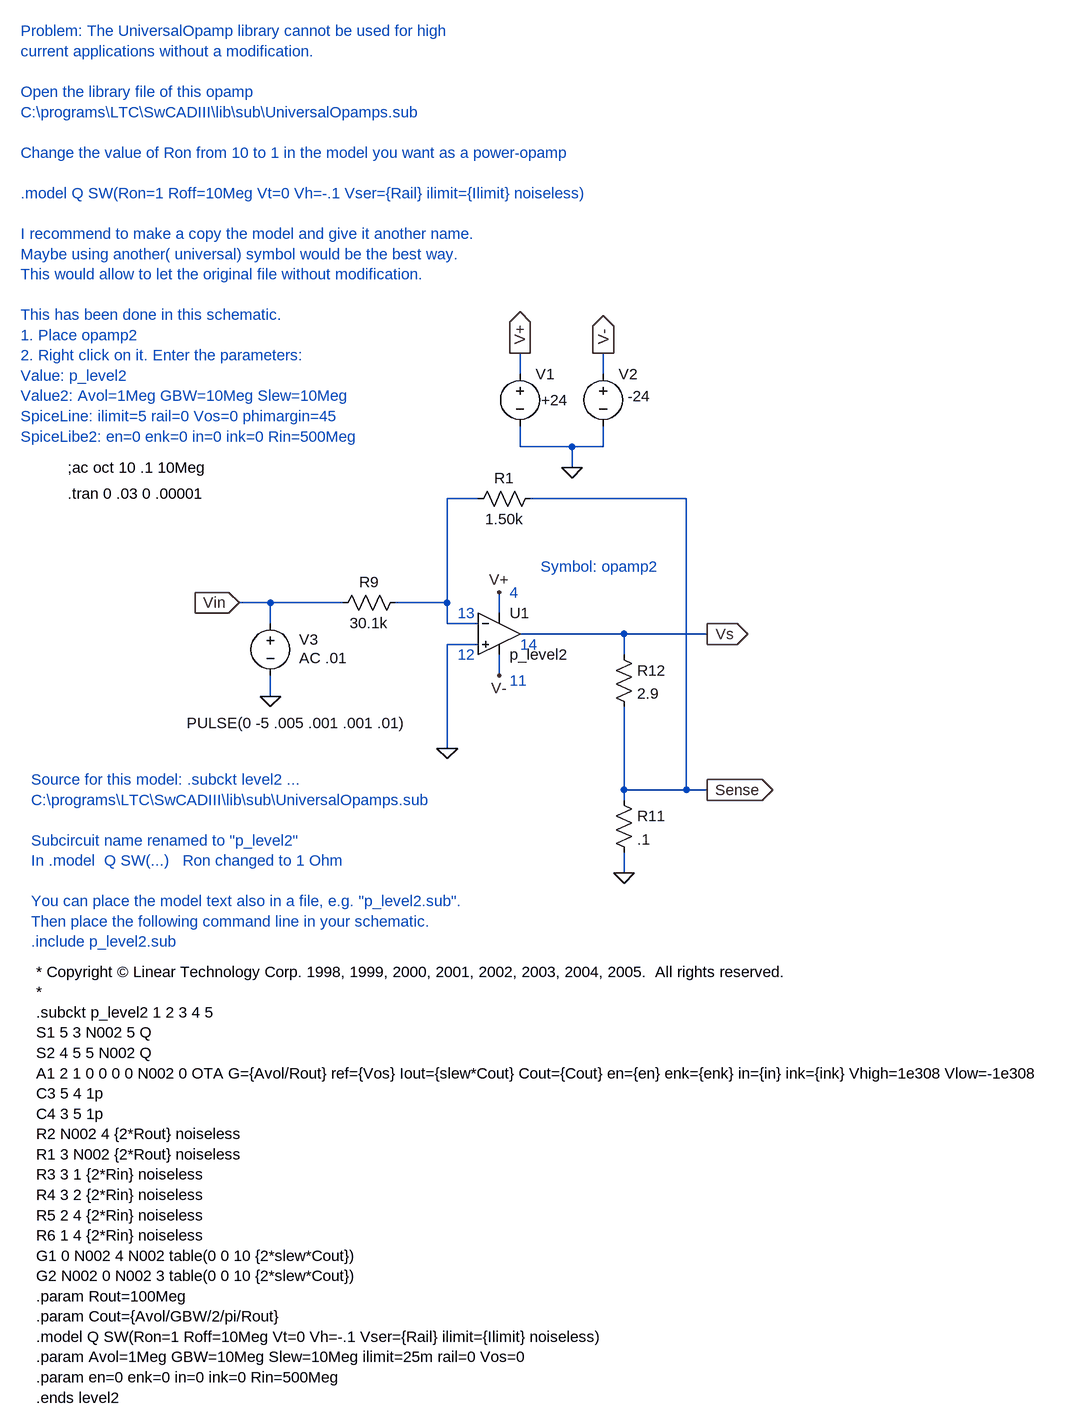
[diagram p0: schematic Power_universalopamp.asc]
Power_universalopamp.asc, the LTspice schematic file:
Version 4
SHEET 1 1204 1316
WIRE -272 144 -320 144
WIRE -272 176 -272 144
WIRE -272 288 -272 256
WIRE -160 144 -272 144
WIRE 0 144 -80 144
WIRE 0 144 0 -16
WIRE 0 176 0 144
WIRE 0 368 0 208
WIRE 48 -16 0 -16
WIRE 48 176 0 176
WIRE 48 208 0 208
WIRE 80 160 80 128
WIRE 80 256 80 224
WIRE 112 -208 112 -240
WIRE 112 -96 112 -128
WIRE 192 -96 112 -96
WIRE 192 -64 192 -96
WIRE 240 -208 240 -240
WIRE 240 -96 192 -96
WIRE 240 -96 240 -128
WIRE 272 192 112 192
WIRE 272 224 272 192
WIRE 272 432 272 304
WIRE 272 448 272 432
WIRE 272 560 272 528
WIRE 368 -16 128 -16
WIRE 368 432 272 432
WIRE 368 432 368 -16
WIRE 400 192 272 192
WIRE 400 432 368 432
FLAG 112 -240 V+
IOPIN 112 -240 Out
FLAG 240 -240 V-
IOPIN 240 -240 Out
FLAG -320 144 Vin
IOPIN -320 144 In
FLAG 192 -64 0
FLAG -272 288 0
FLAG 0 368 0
FLAG 80 128 V+
FLAG 80 256 V-
FLAG 272 560 0
FLAG 400 192 Vs
IOPIN 400 192 Out
FLAG 400 432 Sense
IOPIN 400 432 Out
SYMBOL voltage 112 -224 R0
WINDOW 3 33 56 Left 0
WINDOW 123 0 0 Left 0
WINDOW 39 0 0 Left 0
SYMATTR Value +24
SYMATTR InstName V1
SYMBOL voltage 240 -224 R0
WINDOW 3 38 50 Left 0
WINDOW 123 0 0 Left 0
WINDOW 39 0 0 Left 0
SYMATTR Value -24
SYMATTR InstName V2
SYMBOL voltage -272 160 R0
WINDOW 3 -129 169 Left 0
WINDOW 123 44 69 Left 0
WINDOW 39 0 0 Left 0
WINDOW 0 44 41 Left 0
SYMATTR Value PULSE(0 -5 .005 .001 .001 .01)
SYMATTR Value2 AC .01
SYMATTR InstName V3
SYMBOL res 32 0 R270
WINDOW 0 32 56 VTop 0
WINDOW 3 0 56 VBottom 0
SYMATTR InstName R1
SYMATTR Value 1.50k
SYMBOL res -176 160 R270
WINDOW 0 32 56 VTop 0
WINDOW 3 0 56 VBottom 0
SYMATTR InstName R9
SYMATTR Value 30.1k
SYMBOL res 256 432 R0
SYMATTR InstName R11
SYMATTR Value .1
SYMBOL res 256 208 R0
SYMATTR InstName R12
SYMATTR Value 2.9
SYMBOL Opamps\\opamp2 80 128 R0
SYMATTR InstName U1
SYMATTR Value p_level2
SYMATTR Value2 Avol=1Meg GBW=10Meg Slew=10Meg
SYMATTR SpiceLine ilimit=5 rail=0 Vos=0 phimargin=45
SYMATTR SpiceLine2 en=0 enk=0 in=0 ink=0 Rin=500Meg
TEXT 16 160 Left 0 ;13
TEXT 16 224 Left 0 ;12
TEXT 112 208 Left 0 ;14
TEXT 96 264 Left 0 ;11
TEXT 96 128 Left 0 ;4
TEXT -584 -24 Left 0 !.tran 0 .03 0 .00001
TEXT -584 -64 Left 0 !;ac oct 10 .1 10Meg
TEXT -656 -736 Left 0 ;Problem: The UniversalOpamp library cannot be used for high\ncurrent applications without a modification.\n \nOpen the library file of this opamp \nC:\\programs\\LTC\\SwCADIII\\lib\\sub\\UniversalOpamps.sub\n \nChange the value of Ron from 10 to 1 in the model you want as a power-opamp\n  \n.model Q SW(Ron=1 Roff=10Meg Vt=0 Vh=-.1 Vser={Rail} ilimit={Ilimit} noiseless)\n \nI recommend to make a copy the model and give it another name. \nMaybe using another( universal) symbol would be the best way.\nThis would allow to let the original file without modification.\n \nThis has been done in this schematic.\n1. Place opamp2\n2. Right click on it. Enter the parameters:\nValue: p_level2\nValue2: Avol=1Meg GBW=10Meg Slew=10Meg\nSpiceLine: ilimit=5 rail=0 Vos=0 phimargin=45\nSpiceLibe2: en=0 enk=0 in=0 ink=0 Rin=500Meg
TEXT -632 712 Left 0 !* Copyright © Linear Technology Corp. 1998, 1999, 2000, 2001, 2002, 2003, 2004, 2005.  All rights reserved.\n*\n.subckt p_level2 1 2 3 4 5\nS1 5 3 N002 5 Q\nS2 4 5 5 N002 Q\nA1 2 1 0 0 0 0 N002 0 OTA G={Avol/Rout} ref={Vos} Iout={slew*Cout} Cout={Cout} en={en} enk={enk} in={in} ink={ink} Vhigh=1e308 Vlow=-1e308\nC3 5 4 1p\nC4 3 5 1p\nR2 N002 4 {2*Rout} noiseless\nR1 3 N002 {2*Rout} noiseless\nR3 3 1 {2*Rin} noiseless\nR4 3 2 {2*Rin} noiseless\nR5 2 4 {2*Rin} noiseless\nR6 1 4 {2*Rin} noiseless\nG1 0 N002 4 N002 table(0 0 10 {2*slew*Cout})\nG2 N002 0 N002 3 table(0 0 10 {2*slew*Cout})\n.param Rout=100Meg\n.param Cout={Avol/GBW/2/pi/Rout}\n.model Q SW(Ron=1 Roff=10Meg Vt=0 Vh=-.1 Vser={Rail} ilimit={Ilimit} noiseless)\n.param Avol=1Meg GBW=10Meg Slew=10Meg ilimit=25m rail=0 Vos=0\n.param en=0 enk=0 in=0 ink=0 Rin=500Meg\n.ends level2
TEXT -640 416 Left 0 ;Source for this model: .subckt level2 ...\nC:\\programs\\LTC\\SwCADIII\\lib\\sub\\UniversalOpamps.sub\n \nSubcircuit name renamed to "p_level2"\nIn .model  Q SW(...)   Ron changed to 1 Ohm\n \nYou can place the model text also in a file, e.g. "p_level2.sub".\nThen place the following command line in your schematic.\n.include p_level2.sub
TEXT 144 88 Left 0 ;Symbol: opamp2

The netlist it stands for:
* Power_universalopamp.asc
V1 V+ 0 +24
V2 V- 0 -24
V3 Vin 0 PULSE(0 -5 .005 .001 .001 .01) AC .01
R1 N001 Sense 1.50k
R9 Vin N001 30.1k
R11 Sense 0 .1
R12 Vs Sense 2.9
XU1 0 N001 V+ V- Vs p_level2 Avol=1Meg GBW=10Meg Slew=10Meg ilimit=5 rail=0 Vos=0 phimargin=45 en=0 enk=0 in=0 ink=0 Rin=500Meg  ; pins In+ In- V+ V- OUT
* 13
* 12
* 14
* 11
* 4
.tran 0 .03 0 .00001
;ac oct 10 .1 10Meg
* Problem: The UniversalOpamp library cannot be used for high
* current applications without a modification.
* Open the library file of this opamp
* C:\programs\LTC\SwCADIII\lib\sub\UniversalOpamps.sub
* Change the value of Ron from 10 to 1 in the model you want as a power-opamp
* .model Q SW(Ron=1 Roff=10Meg Vt=0 Vh=-.1 Vser={Rail} ilimit={Ilimit} noiseless)
* I recommend to make a copy the model and give it another name.
* Maybe using another( universal) symbol would be the best way.
* This would allow to let the original file without modification.
* This has been done in this schematic.
* 1. Place opamp2
* 2. Right click on it. Enter the parameters:
* Value: p_level2
* Value2: Avol=1Meg GBW=10Meg Slew=10Meg
* SpiceLine: ilimit=5 rail=0 Vos=0 phimargin=45
* SpiceLibe2: en=0 enk=0 in=0 ink=0 Rin=500Meg
* Copyright © Linear Technology Corp. 1998, 1999, 2000, 2001, 2002, 2003, 2004, 2005.  All rights reserved.
*
.subckt p_level2 1 2 3 4 5
S1 5 3 N002 5 Q
S2 4 5 5 N002 Q
A1 2 1 0 0 0 0 N002 0 OTA G={Avol/Rout} ref={Vos} Iout={slew*Cout} Cout={Cout} en={en} enk={enk} in={in} ink={ink} Vhigh=1e308 Vlow=-1e308
C3 5 4 1p
C4 3 5 1p
R2 N002 4 {2*Rout} noiseless
R1 3 N002 {2*Rout} noiseless
R3 3 1 {2*Rin} noiseless
R4 3 2 {2*Rin} noiseless
R5 2 4 {2*Rin} noiseless
R6 1 4 {2*Rin} noiseless
G1 0 N002 4 N002 table(0 0 10 {2*slew*Cout})
G2 N002 0 N002 3 table(0 0 10 {2*slew*Cout})
.param Rout=100Meg
.param Cout={Avol/GBW/2/pi/Rout}
.model Q SW(Ron=1 Roff=10Meg Vt=0 Vh=-.1 Vser={Rail} ilimit={Ilimit} noiseless)
.param Avol=1Meg GBW=10Meg Slew=10Meg ilimit=25m rail=0 Vos=0
.param en=0 enk=0 in=0 ink=0 Rin=500Meg
.ends level2
* Source for this model: .subckt level2 ...
* C:\programs\LTC\SwCADIII\lib\sub\UniversalOpamps.sub
* Subcircuit name renamed to "p_level2"
* In .model  Q SW(...)   Ron changed to 1 Ohm
* You can place the model text also in a file, e.g. "p_level2.sub".
* Then place the following command line in your schematic.
* .include p_level2.sub
* Symbol: opamp2
.backanno
.end